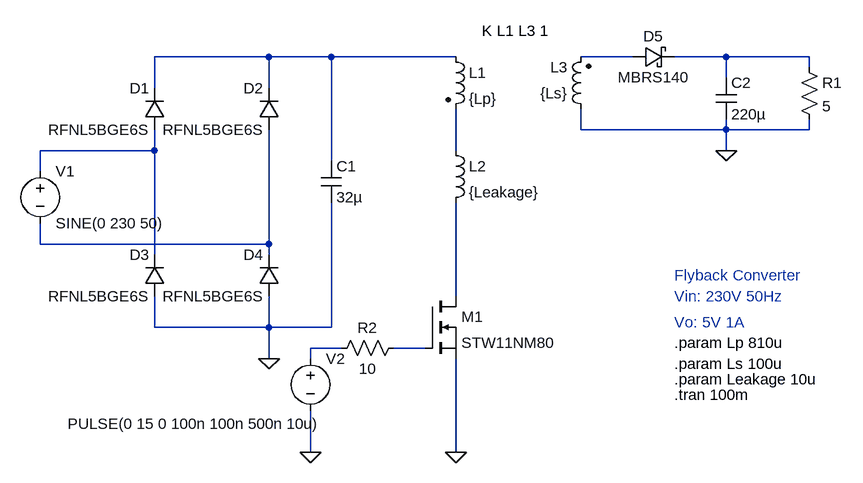
[diagram p0: schematic flyBack.asc]
flyBack.asc, the LTspice schematic file:
Version 4
SHEET 1 1208 680
WIRE 320 -32 144 -32
WIRE 416 -32 320 -32
WIRE 608 -32 416 -32
WIRE 880 -32 800 -32
WIRE 1024 -32 944 -32
WIRE 1152 -32 1024 -32
WIRE 1152 -16 1152 -32
WIRE 1024 0 1024 -32
WIRE 144 16 144 -32
WIRE 320 16 320 -32
WIRE 800 80 800 48
WIRE 1024 80 1024 64
WIRE 1024 80 800 80
WIRE 1152 80 1152 64
WIRE 1152 80 1024 80
WIRE 144 112 144 80
WIRE 144 112 -32 112
WIRE 608 112 608 48
WIRE 1024 112 1024 80
WIRE 416 128 416 -32
WIRE -32 144 -32 112
WIRE -32 256 -32 224
WIRE 320 256 320 80
WIRE 320 256 -32 256
WIRE 144 272 144 112
WIRE 320 272 320 256
WIRE 608 336 608 192
WIRE 144 384 144 336
WIRE 320 384 320 336
WIRE 320 384 144 384
WIRE 416 384 416 192
WIRE 416 384 320 384
WIRE 432 416 384 416
WIRE 560 416 512 416
WIRE 320 432 320 384
WIRE 384 432 384 416
WIRE 384 576 384 512
WIRE 608 576 608 432
FLAG 384 576 0
FLAG 608 576 0
FLAG 1024 112 0
FLAG 320 432 0
SYMBOL voltage -32 128 R0
WINDOW 123 0 0 Left 0
WINDOW 39 0 0 Left 0
SYMATTR InstName V1
SYMATTR Value SINE(0 230 50)
SYMBOL diode 160 80 R180
WINDOW 0 24 64 Left 2
WINDOW 3 24 0 Left 2
SYMATTR InstName D1
SYMATTR Value RFNL5BGE6S
SYMBOL cap 400 128 R0
SYMATTR InstName C1
SYMATTR Value 32µ
SYMBOL ind2 592 -48 R0
SYMATTR InstName L1
SYMATTR Value {Lp}
SYMATTR Type ind
SYMBOL ind 592 96 R0
SYMATTR InstName L2
SYMATTR Value {Leakage}
SYMBOL ind2 816 64 R180
WINDOW 0 36 80 Left 2
WINDOW 3 36 40 Left 2
SYMATTR InstName L3
SYMATTR Value {Ls}
SYMATTR Type ind
SYMBOL schottky 880 -16 R270
WINDOW 0 32 32 VTop 2
WINDOW 3 0 32 VBottom 2
SYMATTR InstName D5
SYMATTR Value MBRS140
SYMATTR Description Diode
SYMATTR Type diode
SYMBOL cap 1008 0 R0
SYMATTR InstName C2
SYMATTR Value 220µ
SYMBOL res 1136 -32 R0
SYMATTR InstName R1
SYMATTR Value 5
SYMBOL nmos 560 336 R0
SYMATTR InstName M1
SYMATTR Value STW11NM80
SYMBOL res 528 400 R90
WINDOW 0 0 56 VBottom 2
WINDOW 3 32 56 VTop 2
SYMATTR InstName R2
SYMATTR Value 10
SYMBOL voltage 384 416 R0
WINDOW 3 -374 116 Left 2
WINDOW 123 0 0 Left 0
WINDOW 39 0 0 Left 0
SYMATTR InstName V2
SYMATTR Value PULSE(0 15 0 100n 100n 500n 10u)
SYMBOL diode 336 80 R180
WINDOW 0 24 64 Left 2
WINDOW 3 24 0 Left 2
SYMATTR InstName D2
SYMATTR Value RFNL5BGE6S
SYMBOL diode 160 336 R180
WINDOW 0 24 64 Left 2
WINDOW 3 24 0 Left 2
SYMATTR InstName D3
SYMATTR Value RFNL5BGE6S
SYMBOL diode 336 336 R180
WINDOW 0 24 64 Left 2
WINDOW 3 24 0 Left 2
SYMATTR InstName D4
SYMATTR Value RFNL5BGE6S
TEXT 648 -72 Left 2 !K L1 L3 1
TEXT 944 304 Left 2 ;Flyback Converter
TEXT 944 336 Left 2 ;Vin: 230V 50Hz
TEXT 944 376 Left 2 ;Vo: 5V 1A
TEXT 944 408 Left 2 !.param Lp 810u
TEXT 944 440 Left 2 !.param Ls 100u
TEXT 944 464 Left 2 !.param Leakage 10u
TEXT 944 488 Left 2 !.tran 100m

The netlist it stands for:
* flyBack.asc
V1 N004 N006 SINE(0 230 50)
D1 N004 N001 RFNL5BGE6S
C1 N001 0 32µ
L1 N001 N005 {Lp}
L2 N005 N007 {Leakage}
L3 0 N002 {Ls}
D5 N002 N003 MBRS140
C2 N003 0 220µ
R1 N003 0 5
M1 N007 N009 0 0 STW11NM80
R2 N009 N008 10
V2 N008 0 PULSE(0 15 0 100n 100n 500n 10u)
D2 N006 N001 RFNL5BGE6S
D3 0 N004 RFNL5BGE6S
D4 0 N006 RFNL5BGE6S
.model D D
.lib standard.dio
.model NMOS NMOS
.model PMOS PMOS
.lib standard.mos
K L1 L3 1
* Flyback Converter
* Vin: 230V 50Hz
* Vo: 5V 1A
.param Lp 810u
.param Ls 100u
.param Leakage 10u
.tran 100m
.backanno
.end